# EAGLE design Печатная плата принимающая ось Y (EAGLE 9.0.0)
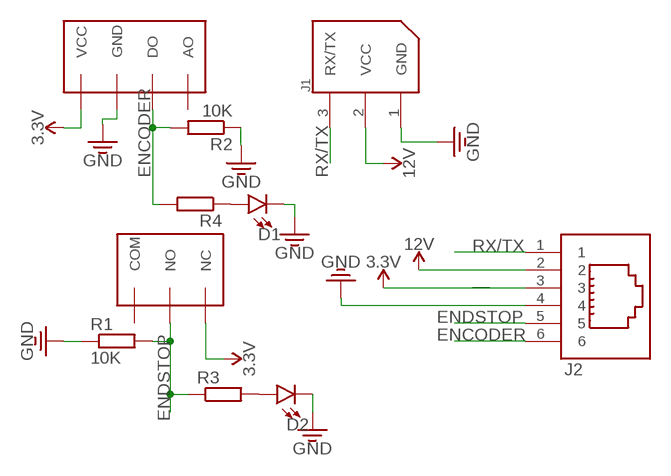
[diagram p0: schematic, sheet 1]

## Parts
D1  LED5MM  [LED_5MM]
D2  LED5MM  [LED_5MM]
J1  22-03-5035  [5267-3]
J2  615006138421  [615006138421]
R1  10K  R-EU_0204/7  [0204/7]
R2  10K  R-EU_0204/7  [0204/7]
R3  R-EU_0204/7  [0204/7]
R4  R-EU_0204/7  [0204/7]
U$1  OPTICAL_ENCODER_FC-01  [OPTICAL_ENCODER_FC-01]
U$2  ENDSTOP  [ENDSTOP]

## Nets
3.3V: J2.3 U$1.VCC U$2.NC
12V: J1.2(VCC) J2.2
ENCODER: J2.6 R2.2 R4.2 U$1.DO
ENDSTOP: J2.5 R1.2 R3.1 U$2.NO
GND: D1.K(C) D2.K(C) J1.1(GND) J2.4 R1.1 R2.1 U$1.GND
N$1: D2.A R3.2
N$2: D1.A R4.1
RX/TX: J1.3(RX/TX) J2.1
Unconnected: U$1.AO U$2.COM

## Library data of the parts
D1 D2 = SparkFun-LED:LED: LED (Generic) Standard schematic elements and footprints for 5mm, 3mm, 1206, and 0603 sized LEDs. Generic LEDs with no color specified.
J1 = molex:22-03-5035: Molex SPOX Vert, Tin (Dynamixel AX/MX Bus) tested: YES (arbotix)
J2 = Wurth_Elektronik_Electromechanic_Input-Output_Connectors_rev16a:615006138421: WR-MJ Horizontal Plastic 6P6C Modular Jack Tab Up, 6 Pins=>Code : Con_I-O_MJ-H_Plastic_Up_615006138421 <http://katalog.we-online.de/media/images/eican/Con_I-O_MJ-H_Plastic_Up_6150xx138421_pf2.jpg> Details see: http://katalog.we-online.de/en/em/615_0xx_138_121 Created 2014-07-10, Karrer Zheng 2014 (C) Würth Elektronik
R1-R4 = resistor:R-EU_: RESISTOR, European symbol
U$1 = other components:OPTICAL_ENCODER_FC-01
U$2 = other components:ENDSTOP

## Board
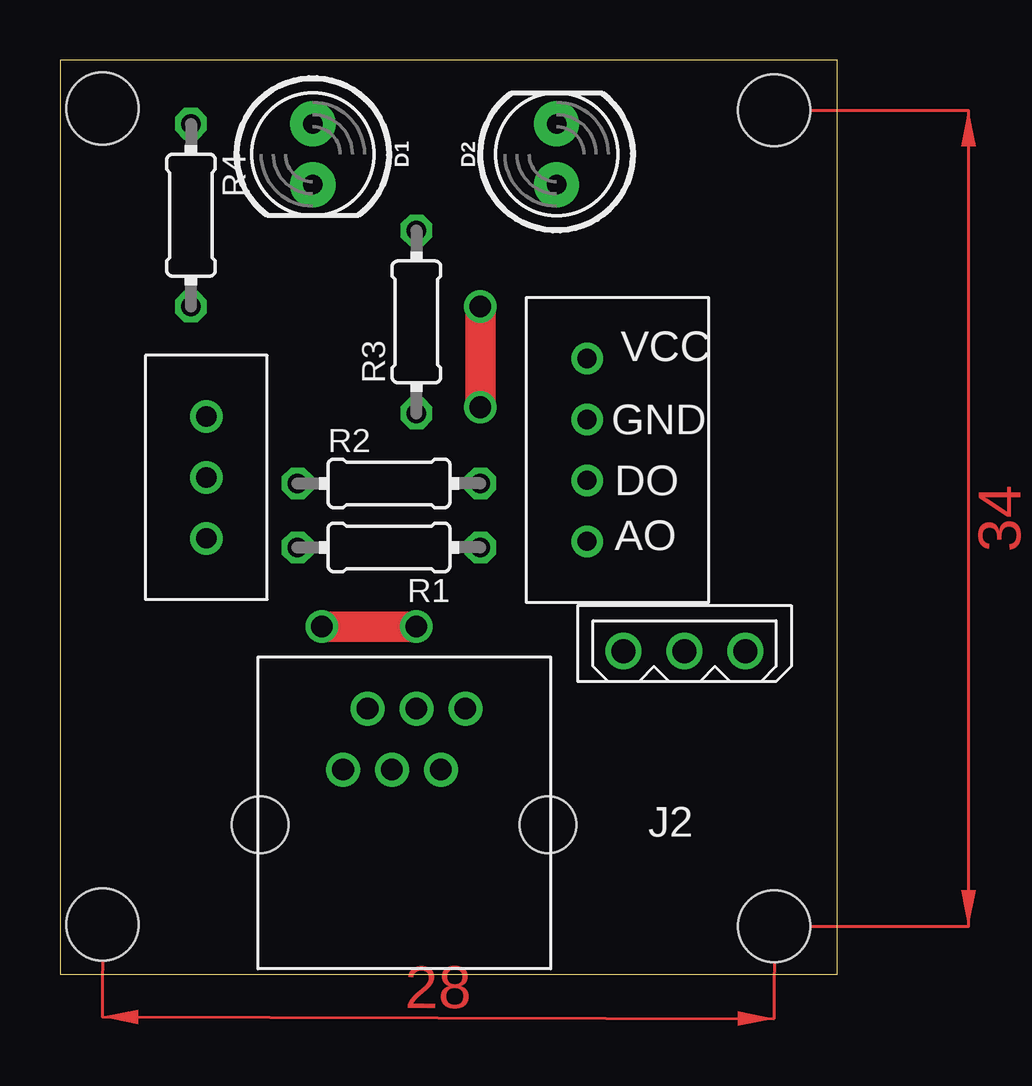
[diagram p1: board, top side]
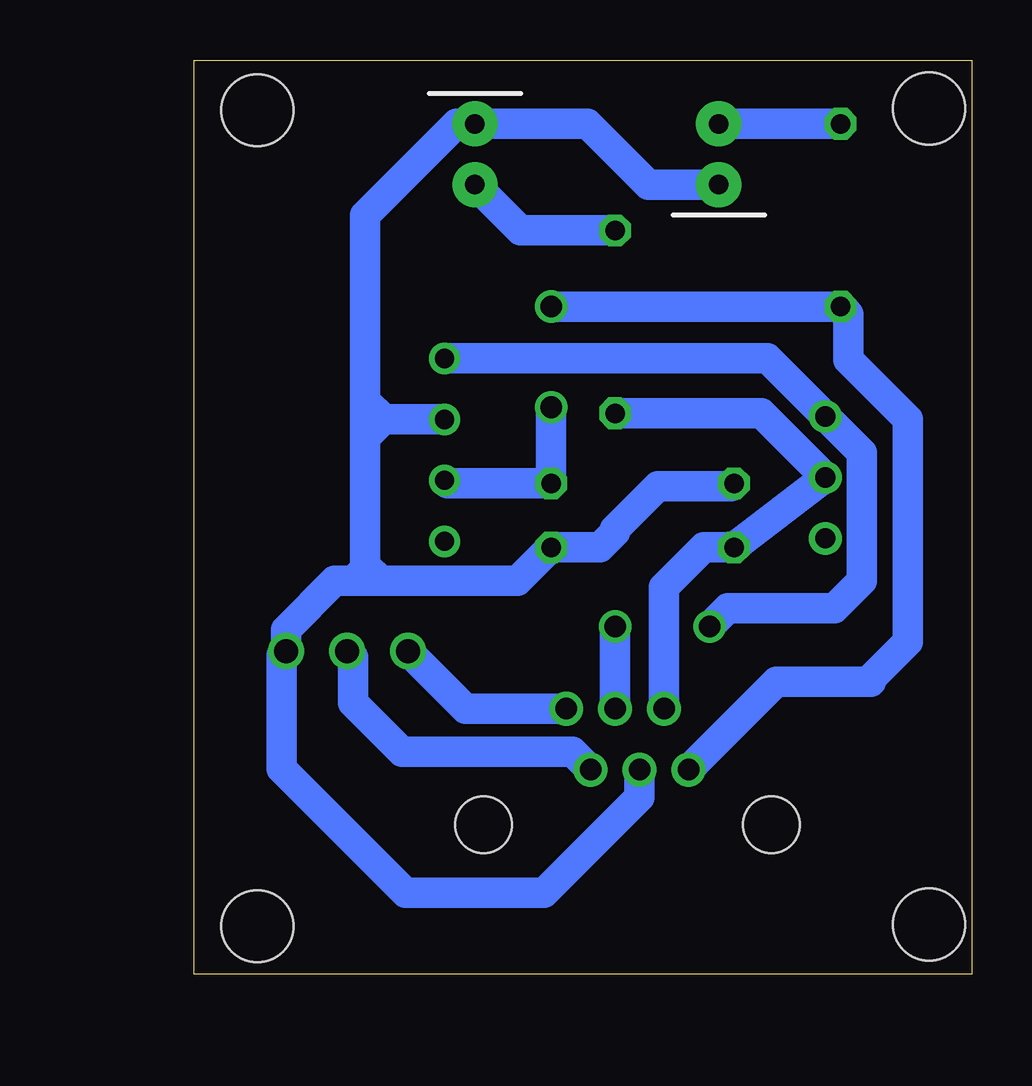
[diagram p2: board, bottom side, seen from below]

Size 32.4 x 38.09 mm. Coordinates in mm from the lower left corner, seen from the top.
Outline: 0,0 32.4,0 32.4,38.09 0,38.09 0,0
Copper layers (1*16): Top 0.035mm / dielectric 1.5mm / Bottom 0.035mm
Design rules "default": minimum track width 6mil, minimum drill 0.35mm, track to track 6mil, track to pad 6mil, pad to pad 6mil, via to via 6mil, smd to smd 6mil, copper to edge 40mil, drill to drill 6mil, minimum pad ring 10mil, minimum via ring 8mil, stop-mask expansion 4mil, vias tented up to drill 0mil, thermal gap 10mil
Holes 3 mm at 1.78,36.07 29.78,35.99 1.78,2.07 29.78,2

### Footprints (pad centres in the part's own frame; a part is rotated, then mirrored left to right if it is on the bottom)
LED_5MM = drill 0.813 pad 1.88: A -1.27,0; K 1.27,0
5267-3 = drill 1: 1 0,0; 2 -2.54,0; 3 -5.08,0
615006138421 = drill 0.9: 1 2.55,4.84; 2 1.53,2.3; 3 0.51,4.84; 4 -0.51,2.3; 5 -1.53,4.84; 6 -2.55,2.3 | hole 2.36: -6,0; 6,0
0204/7 = drill 0.813 octagon: 1 -3.81,0; 2 3.81,0
OPTICAL_ENCODER_FC-01 = drill 0.8: AO 2.54,0; DO 0,0; GND -2.54,0; VCC -5.08,0
ENDSTOP = drill 0.85: COM -7.62,0; NC -2.54,0; NO -5.08,0

### Placement (x,y rotation side)
D1  10.54,34.16 270 top
D2  20.7,34.16 90 top
J1  28.57,13.46 0 top
J2  14.35,6.22 0 top
R1  13.72,17.78 180 top
R2  13.72,20.45 0 top
R3  14.86,27.18 90 top
R4  5.46,31.62 270 top
U$1  21.97,20.57 270 top
U$2  6.1,25.78 90 top

### Tracks (layer width: path | path; a pad name or v marks a point on that pad's centre or on a via)
3.3V  (via drill 0.9)
  Top 1.27: v10.92,14.48 v14.86,14.48
  Bottom 1.27: U$1.VCC 8.51,25.65 U$2.NC 4.57,21.72 4.57,16.38 5.71,15.24 10.16,15.24 v10.92,14.48 | v14.86,14.48 J2.3
12V
  Bottom 1.27: J2.2 16.63,9.27 23.75,9.27 25.78,11.3 25.78,13.21 J1.2
ENCODER  (via drill 0.9)
  Top 1.27: v17.53,27.81 v17.53,23.62
  Bottom 1.27: U$1.DO 21.84,20.45 R2.2 v17.53,23.62 | v17.53,27.81 R4.2 5.14,27.5 5.14,25.59 2.67,23.11 2.67,13.84 4.19,12.32 4.19,12.19 8.13,12.19 J2.6
ENDSTOP
  Bottom 1.27: R3.1 8.76,23.37 U$2.NO R1.2 11.16,17.78 12.82,16.12 J2.5
GND
  Bottom 1.27: R2.1 10.03,20.32 13.08,20.32 14.86,18.54 14.86,18.41 15.49,17.78 R1.1 18.92,16.38 24.64,16.38 | 24.64,16.38 25.78,16.38 | 25.78,16.38 26.54,16.38 28.57,14.35 J1.1 28.75,13.28 28.75,8.56 23.58,3.39 17.82,3.39 13.84,7.37 J2.4 | U$1.GND 24.51,23.11 | 24.51,23.11 25.27,22.35 | 25.27,22.35 25.27,17.02 | 25.27,17.02 24.64,16.38 | 25.27,17.02 25.27,16.89 25.78,16.38 | 25.27,23.88 25.27,31.62 21.46,35.43 D2.K 16,35.43 13.46,32.89 D1.K | 25.27,23.88 25.27,22.35 | 24.51,23.11 25.27,23.88
N$1
  Bottom 1.27: R3.2 18.8,30.99 D2.A
N$2
  Bottom 1.27: R4.1 D1.A
RX/TX
  Bottom 1.27: J2.1 21.1,11.06 J1.3
(copper drawn outside any net)
  shapes: Top area x2